# Altium schematic sheet InkJetFin - ATSAM3X8C MCU.SchDoc
size A
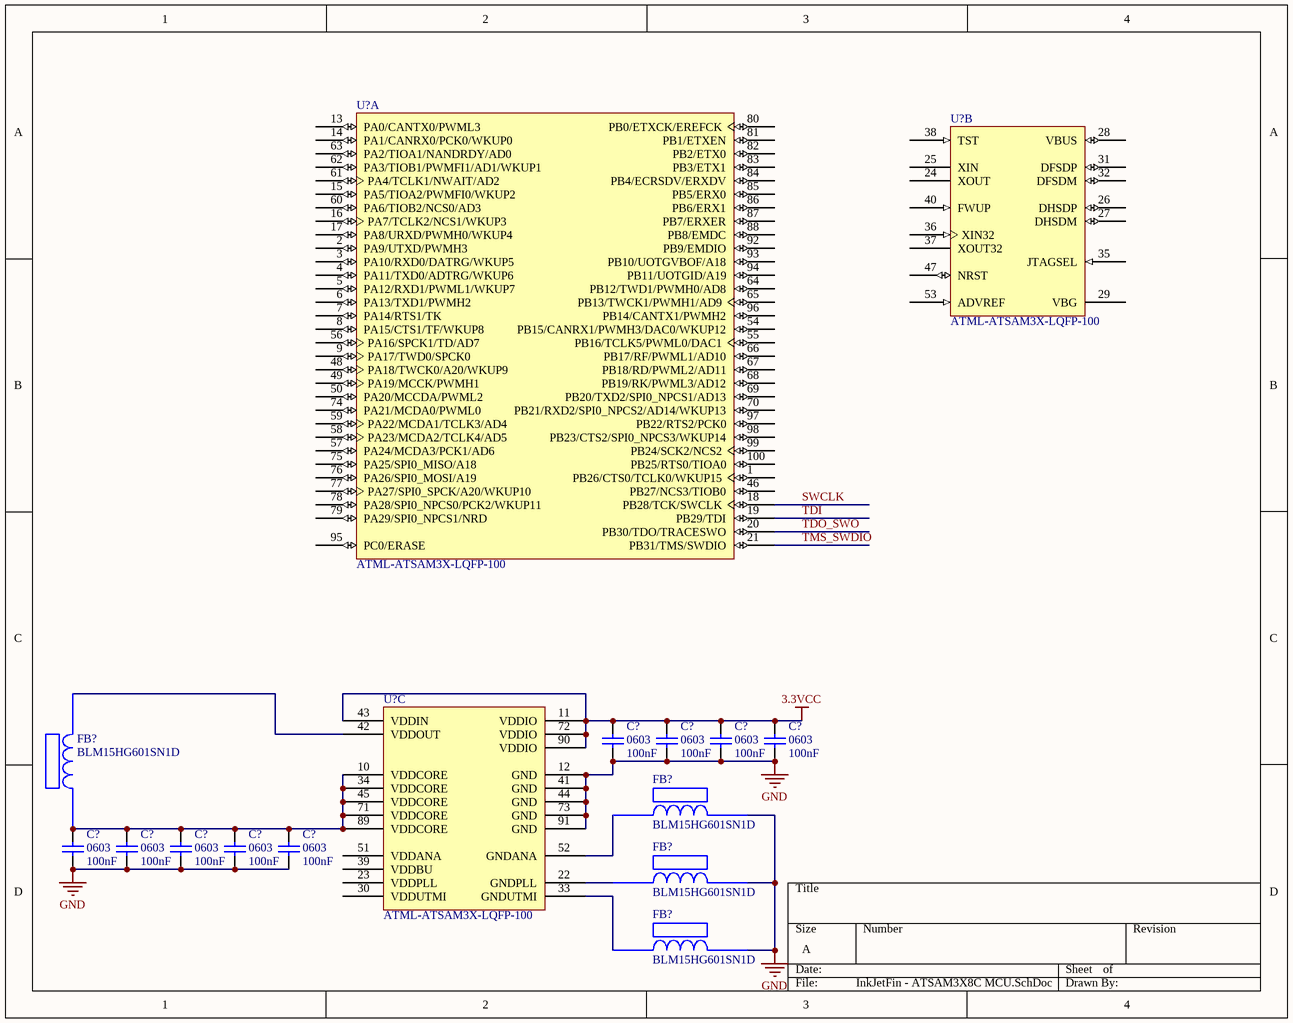
[diagram p0: InkJetFin - ATSAM3X8C MCU.SchDoc]

## Parts
(Parts that share a designator on the sheet are numbered #1, #2 ... from top to bottom, then left to right.)
C?#1  0603  value 100nF  [1608[0603]]
C?#2  0603  value 100nF  [1608[0603]]
C?#3  0603  value 100nF  [1608[0603]]
C?#4  0603  value 100nF  [1608[0603]]
C?#5  0603  value 100nF  [1608[0603]]
C?#6  0603  value 100nF  [1608[0603]]
C?#7  0603  value 100nF  [1608[0603]]
C?#8  0603  value 100nF  [1608[0603]]
C?#9  0603  value 100nF  [1608[0603]]
FB?#1  BLM15HG601SN1D  [BLM18PG121SN1D]
FB?#2  BLM15HG601SN1D  [BLM18PG121SN1D]
FB?#3  BLM15HG601SN1D  [BLM18PG121SN1D]
FB?#4  BLM15HG601SN1D  [BLM18PG121SN1D]
U?#1  ATML-ATSAM3X-LQFP-100  [LQFP100_M]  (part A of 3)
U?#2  ATML-ATSAM3X-LQFP-100  [LQFP100_M]  (part B of 3)
U?#3  ATML-ATSAM3X-LQFP-100  [LQFP100_M]  (part C of 3)

## Nets
3.3VCC: C?#1.2 C?#2.2 C?#3.2 C?#4.2 U?#3.11(VDDIO) U?#3.43(VDDIN) U?#3.72(VDDIO) U?#3.90(VDDIO)
GND: C?#1.1 C?#2.1 C?#3.1 C?#4.1 C?#5.1 C?#6.1 C?#7.1 C?#8.1 C?#9.1 FB?#2.2 FB?#3.2 FB?#4.2 U?#3.12(GND) U?#3.41(GND) U?#3.44(GND) U?#3.73(GND) U?#3.91(GND)
SWCLK: U?#1.18(PB28/TCK/SWCLK)
TDI: U?#1.19(PB29/TDI)
TDO_SWO: U?#1.20(PB30/TDO/TRACESWO)
TMS_SWDIO: U?#1.21(PB31/TMS/SWDIO)
NetC?#5_2: C?#5.2 C?#6.2 C?#7.2 C?#8.2 C?#9.2 FB?#1.1 U?#3.10(VDDCORE) U?#3.34(VDDCORE) U?#3.45(VDDCORE) U?#3.71(VDDCORE) U?#3.89(VDDCORE)
NetFB?#1_2: FB?#1.2 U?#3.42(VDDOUT)
NetFB?#2_1: FB?#2.1 U?#3.52(GNDANA)
NetFB?#3_1: FB?#3.1 U?#3.22(GNDPLL)
NetFB?#4_1: FB?#4.1 U?#3.33(GNDUTMI)

Not connected (* = marked no-connect by the designer): U?#1 1(PB26/CTS0/TCLK0/WKUP15) 2(PA9/UTXD/PWMH3) 3(PA10/RXD0/DATRG/WKUP5) 4(PA11/TXD0/ADTRG/WKUP6) 5(PA12/RXD1/PWML1/WKUP7) 6(PA13/TXD1/PWMH2) 7(PA14/RTS1/TK) 8(PA15/CTS1/TF/WKUP8) 9(PA17/TWD0/SPCK0) 13(PA0/CANTX0/PWML3) 14(PA1/CANRX0/PCK0/WKUP0) 15(PA5/TIOA2/PWMFI0/WKUP2) 16(PA7/TCLK2/NCS1/WKUP3) 17(PA8/URXD/PWMH0/WKUP4) 46(PB27/NCS3/TIOB0) 48(PA18/TWCK0/A20/WKUP9) 49(PA19/MCCK/PWMH1) 50(PA20/MCCDA/PWML2) 54(PB15/CANRX1/PWMH3/DAC0/WKUP12) 55(PB16/TCLK5/PWML0/DAC1) 56(PA16/SPCK1/TD/AD7) 57(PA24/MCDA3/PCK1/AD6) 58(PA23/MCDA2/TCLK4/AD5) 59(PA22/MCDA1/TCLK3/AD4) 60(PA6/TIOB2/NCS0/AD3) 61(PA4/TCLK1/NWAIT/AD2) 62(PA3/TIOB1/PWMFI1/AD1/WKUP1) 63(PA2/TIOA1/NANDRDY/AD0) 64(PB12/TWD1/PWMH0/AD8) 65(PB13/TWCK1/PWMH1/AD9) 66(PB17/RF/PWML1/AD10) 67(PB18/RD/PWML2/AD11) 68(PB19/RK/PWML3/AD12) 69(PB20/TXD2/SPI0_NPCS1/AD13) 70(PB21/RXD2/SPI0_NPCS2/AD14/WKUP13) 74(PA21/MCDA0/PWML0) 75(PA25/SPI0_MISO/A18) 76(PA26/SPI0_MOSI/A19) 77(PA27/SPI0_SPCK/A20/WKUP10) 78(PA28/SPI0_NPCS0/PCK2/WKUP11) 79(PA29/SPI0_NPCS1/NRD) 80(PB0/ETXCK/EREFCK) 81(PB1/ETXEN) 82(PB2/ETX0) 83(PB3/ETX1) 84(PB4/ECRSDV/ERXDV) 85(PB5/ERX0) 86(PB6/ERX1) 87(PB7/ERXER) 88(PB8/EMDC) 92(PB9/EMDIO) 93(PB10/UOTGVBOF/A18) 94(PB11/UOTGID/A19) 95(PC0/ERASE) 96(PB14/CANTX1/PWMH2) 97(PB22/RTS2/PCK0) 98(PB23/CTS2/SPI0_NPCS3/WKUP14) 99(PB24/SCK2/NCS2) 100(PB25/RTS0/TIOA0); U?#2 24(XOUT) 25(XIN) 26(DHSDP) 27(DHSDM) 28(VBUS) 29(VBG) 31(DFSDP) 32(DFSDM) 35(JTAGSEL) 36(XIN32) 37(XOUT32) 38(TST) 40(FWUP) 47(NRST) 53(ADVREF); U?#3 23(VDDPLL) 30(VDDUTMI) 39(VDDBU) 51(VDDANA)

## Library data of the parts
C?#1-C?#9 = Cap Semi: Capacitor (Semiconductor SIM Model); Published: 8-Jun-2000; LatestRevisionDate: 29-May-2009; LatestRevisionNote: IPC-7351 Footprint Added.; PackageReference: C1206; Publisher: Altium Limited; PackageDescription: Chip Capacitor